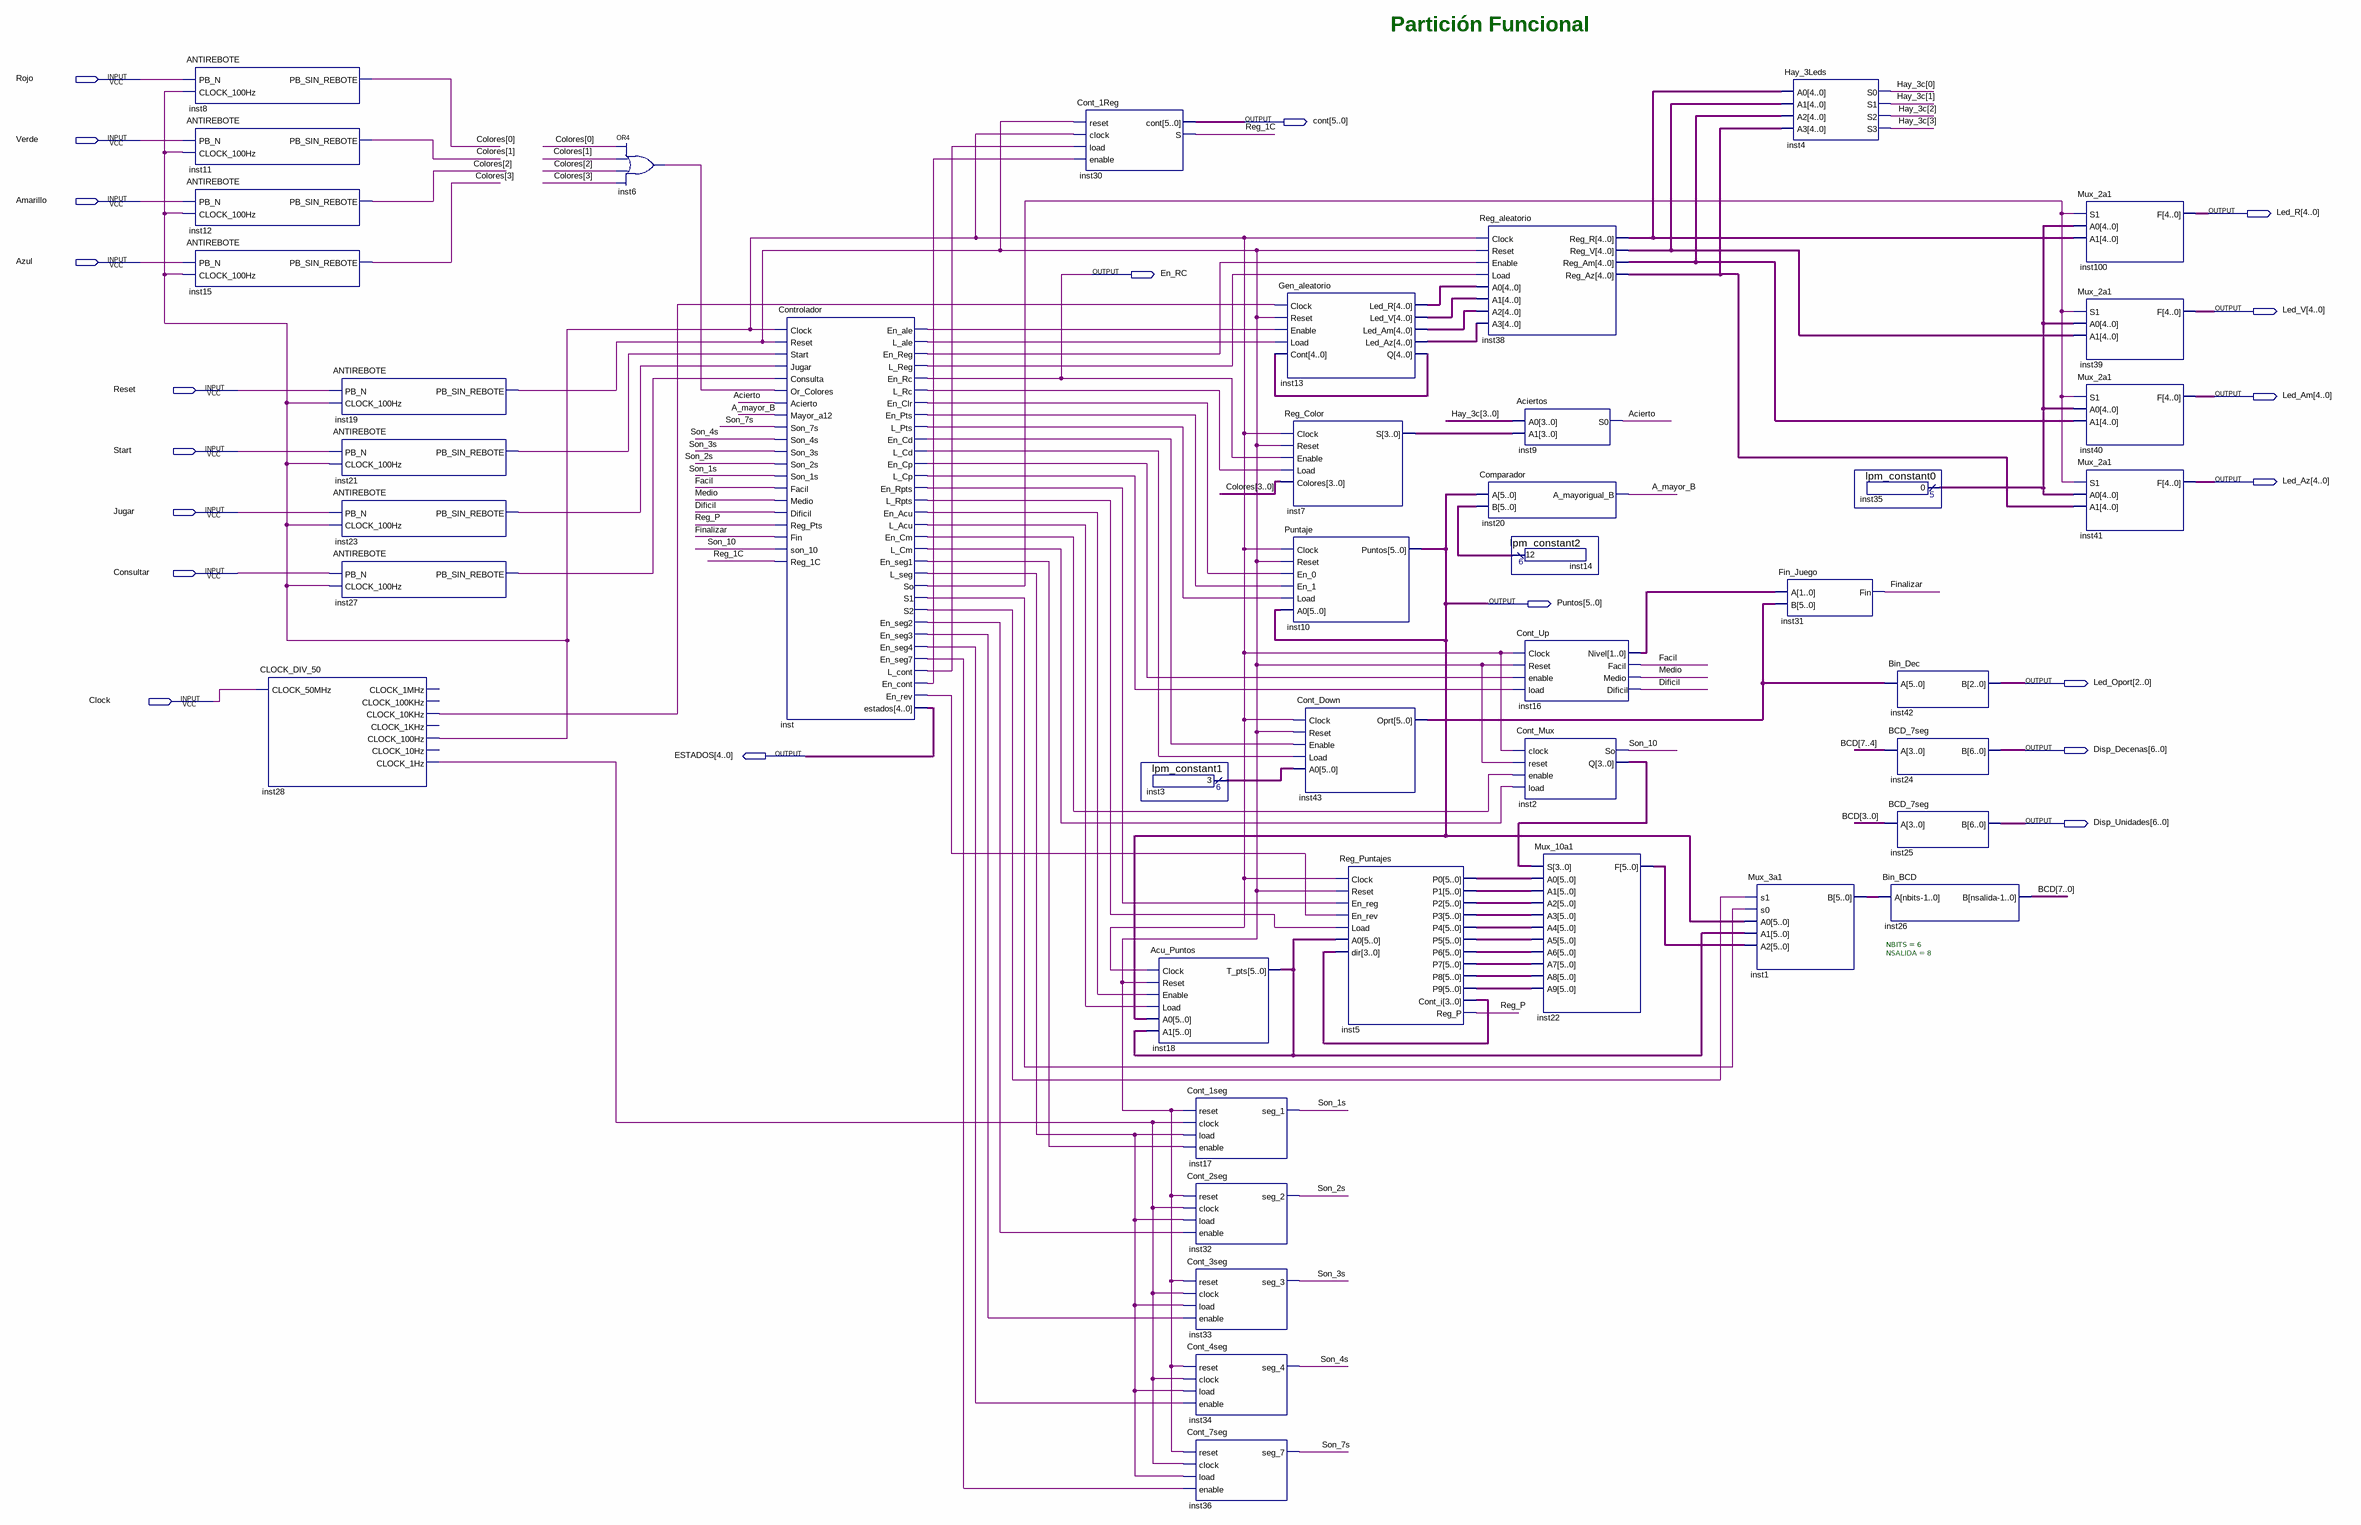
[diagram p0: schematic sheet]
// Quartus schematic Proyecto.bdf as structural Verilog: 43 symbols, 20 pins
module Proyecto (
  input  Rojo,
  input  Verde,
  input  Amarillo,
  input  Azul,
  input  Reset,
  input  Start,
  input  Jugar,
  input  Consultar,
  input  Clock,
  output [5:0] cont,
  output [4:0] Led_R,
  output En_RC,
  output [4:0] Led_V,
  output [4:0] Led_Am,
  output [4:0] Led_Az,
  output [5:0] Puntos,
  output [2:0] Led_Oport,
  output [6:0] Disp_Decenas,
  output [4:0] ESTADOS,
  output [6:0] Disp_Unidades
);

  wire A_mayor_B, Acierto, Dificil, Facil, Finalizar, inst6_out, inst19_pb_sin_rebote, inst21_pb_sin_rebote,
       inst23_pb_sin_rebote, inst27_pb_sin_rebote, inst28_clock_1hz, inst28_clock_10khz, inst28_clock_100hz,
       inst_en_acu, inst_en_ale, inst_en_cd, inst_en_clr, inst_en_cm, inst_en_cont, inst_en_cp, inst_en_pts,
       inst_en_reg, inst_en_rev, inst_en_rpts, inst_en_seg1, inst_en_seg2, inst_en_seg3, inst_en_seg4,
       inst_en_seg7, inst_l_acu, inst_l_ale, inst_l_cd, inst_l_cm, inst_l_cont, inst_l_cp, inst_l_pts,
       inst_l_rc, inst_l_reg, inst_l_rpts, inst_l_seg, inst_s1, inst_s2, inst_so, Medio, Reg_1C, Reg_P,
       Son_1s, Son_2s, Son_3s, Son_4s, Son_7s, Son_10;
  wire [1:0] inst16_nivel;
  wire [3:0] Colores, Hay_3c, inst2_q, inst5_cont_i, inst7_s;
  wire [4:0] inst13_led_am, inst13_led_az, inst13_led_r, inst13_led_v, inst13_q, inst35_result,
       inst38_reg_am, inst38_reg_az, inst38_reg_r, inst38_reg_v;
  wire [5:0] inst1_b, inst3_result, inst5_p0, inst5_p1, inst5_p2, inst5_p3, inst5_p4, inst5_p5, inst5_p6,
       inst5_p7, inst5_p8, inst5_p9, inst14_result, inst18_t_pts, inst22_f, inst43_oprt;
  wire [7:0] BCD;

  ANTIREBOTE inst8 (.PB_N(Rojo), .CLOCK_100Hz(inst28_clock_100hz), .PB_SIN_REBOTE(Colores[0]));
  ANTIREBOTE inst11 (.PB_N(Verde), .CLOCK_100Hz(inst28_clock_100hz), .PB_SIN_REBOTE(Colores[1]));
  ANTIREBOTE inst12 (.PB_N(Amarillo), .CLOCK_100Hz(inst28_clock_100hz), .PB_SIN_REBOTE(Colores[2]));
  ANTIREBOTE inst15 (.PB_N(Azul), .CLOCK_100Hz(inst28_clock_100hz), .PB_SIN_REBOTE(Colores[3]));
  CLOCK_DIV_50 inst28 (
    .CLOCK_50MHz(Clock), .CLOCK_10KHz(inst28_clock_10khz), .CLOCK_100Hz(inst28_clock_100hz),
    .CLOCK_1Hz(inst28_clock_1hz));  // open: CLOCK_1MHz, CLOCK_100KHz, CLOCK_1KHz, CLOCK_10Hz
  ANTIREBOTE inst19 (.PB_N(Reset), .CLOCK_100Hz(inst28_clock_100hz), .PB_SIN_REBOTE(inst19_pb_sin_rebote));
  ANTIREBOTE inst21 (.PB_N(Start), .CLOCK_100Hz(inst28_clock_100hz), .PB_SIN_REBOTE(inst21_pb_sin_rebote));
  ANTIREBOTE inst23 (.PB_N(Jugar), .CLOCK_100Hz(inst28_clock_100hz), .PB_SIN_REBOTE(inst23_pb_sin_rebote));
  ANTIREBOTE inst27 (.PB_N(Consultar), .CLOCK_100Hz(inst28_clock_100hz), .PB_SIN_REBOTE(inst27_pb_sin_rebote));
  or inst6 (inst6_out, Colores[0], Colores[1], Colores[2], Colores[3]);
  Controlador inst (
    .Clock(inst28_clock_100hz), .Reset(inst19_pb_sin_rebote), .Start(inst21_pb_sin_rebote),
    .Jugar(inst23_pb_sin_rebote), .Consulta(inst27_pb_sin_rebote), .Or_Colores(inst6_out), .Acierto(Acierto),
    .Mayor_a12(A_mayor_B), .Son_7s(Son_7s), .Son_4s(Son_4s), .Son_3s(Son_3s), .Son_2s(Son_2s),
    .Son_1s(Son_1s), .Facil(Facil), .Medio(Medio), .Dificil(Dificil), .Reg_Pts(Reg_P), .Fin(Finalizar),
    .son_10(Son_10), .Reg_1C(Reg_1C), .En_ale(inst_en_ale), .L_ale(inst_l_ale), .En_Reg(inst_en_reg),
    .L_Reg(inst_l_reg), .En_Rc(En_RC), .L_Rc(inst_l_rc), .En_Clr(inst_en_clr), .En_Pts(inst_en_pts),
    .L_Pts(inst_l_pts), .En_Cd(inst_en_cd), .L_Cd(inst_l_cd), .En_Cp(inst_en_cp), .L_Cp(inst_l_cp),
    .En_Rpts(inst_en_rpts), .L_Rpts(inst_l_rpts), .En_Acu(inst_en_acu), .L_Acu(inst_l_acu),
    .En_Cm(inst_en_cm), .L_Cm(inst_l_cm), .En_seg1(inst_en_seg1), .L_seg(inst_l_seg), .So(inst_so),
    .S1(inst_s1), .S2(inst_s2), .En_seg2(inst_en_seg2), .En_seg3(inst_en_seg3), .En_seg4(inst_en_seg4),
    .En_seg7(inst_en_seg7), .L_cont(inst_l_cont), .En_cont(inst_en_cont), .En_rev(inst_en_rev),
    .estados(ESTADOS));
  Cont_1Reg inst30 (
    .reset(inst19_pb_sin_rebote), .clock(inst28_clock_100hz), .load(inst_l_cont), .enable(inst_en_cont),
    .cont(cont), .S(Reg_1C));
  lpm_constant1 inst3 (.result(inst3_result));
  Acu_Puntos inst18 (
    .Clock(inst28_clock_100hz), .Reset(inst19_pb_sin_rebote), .Enable(inst_en_acu), .Load(inst_l_acu),
    .A0(Puntos), .A1(inst18_t_pts), .T_pts(inst18_t_pts));
  Cont_1seg inst17 (
    .reset(inst19_pb_sin_rebote), .clock(inst28_clock_1hz), .load(inst_l_seg), .enable(inst_en_seg1),
    .seg_1(Son_1s));
  Cont_2seg inst32 (
    .reset(inst19_pb_sin_rebote), .clock(inst28_clock_1hz), .load(inst_l_seg), .enable(inst_en_seg2),
    .seg_2(Son_2s));
  Cont_3seg inst33 (
    .reset(inst19_pb_sin_rebote), .clock(inst28_clock_1hz), .load(inst_l_seg), .enable(inst_en_seg3),
    .seg_3(Son_3s));
  Cont_4seg inst34 (
    .reset(inst19_pb_sin_rebote), .clock(inst28_clock_1hz), .load(inst_l_seg), .enable(inst_en_seg4),
    .seg_4(Son_4s));
  Cont_7seg inst36 (
    .reset(inst19_pb_sin_rebote), .clock(inst28_clock_1hz), .load(inst_l_seg), .enable(inst_en_seg7),
    .seg_7(Son_7s));
  Gen_aleatorio inst13 (
    .Clock(inst28_clock_10khz), .Reset(inst19_pb_sin_rebote), .Enable(inst_en_ale), .Load(inst_l_ale),
    .Cont(inst13_q), .Led_R(inst13_led_r), .Led_V(inst13_led_v), .Led_Am(inst13_led_am),
    .Led_Az(inst13_led_az), .Q(inst13_q));
  Reg_Color inst7 (
    .Clock(inst28_clock_100hz), .Reset(inst19_pb_sin_rebote), .Enable(En_RC), .Load(inst_l_rc),
    .Colores(Colores), .S(inst7_s));
  Puntaje inst10 (
    .Clock(inst28_clock_100hz), .Reset(inst19_pb_sin_rebote), .En_0(inst_en_clr), .En_1(inst_en_pts),
    .Load(inst_l_pts), .A0(Puntos), .Puntos(Puntos));
  Cont_Down inst43 (
    .Clock(inst28_clock_100hz), .Reset(inst19_pb_sin_rebote), .Enable(inst_en_cd), .Load(inst_l_cd),
    .A0(inst3_result), .Oprt(inst43_oprt));
  Reg_Puntajes inst5 (
    .Clock(inst28_clock_100hz), .Reset(inst19_pb_sin_rebote), .En_reg(inst_en_rpts), .En_rev(inst_en_rev),
    .Load(inst_l_rpts), .A0(inst18_t_pts), .dir(inst5_cont_i), .P0(inst5_p0), .P1(inst5_p1), .P2(inst5_p2),
    .P3(inst5_p3), .P4(inst5_p4), .P5(inst5_p5), .P6(inst5_p6), .P7(inst5_p7), .P8(inst5_p8), .P9(inst5_p9),
    .Cont_i(inst5_cont_i), .Reg_P(Reg_P));
  Reg_aleatorio inst38 (
    .Clock(inst28_clock_100hz), .Reset(inst19_pb_sin_rebote), .Enable(inst_en_reg), .Load(inst_l_reg),
    .A0(inst13_led_r), .A1(inst13_led_v), .A2(inst13_led_am), .A3(inst13_led_az), .Reg_R(inst38_reg_r),
    .Reg_V(inst38_reg_v), .Reg_Am(inst38_reg_am), .Reg_Az(inst38_reg_az));
  Comparador inst20 (.A(Puntos), .B(inst14_result), .A_mayorigual_B(A_mayor_B));
  Aciertos inst9 (.A0(Hay_3c), .A1(inst7_s), .S0(Acierto));
  lpm_constant2 inst14 (.result(inst14_result));
  Cont_Up inst16 (
    .Clock(inst28_clock_100hz), .Reset(inst19_pb_sin_rebote), .enable(inst_en_cp), .load(inst_l_cp),
    .Nivel(inst16_nivel), .Facil(Facil), .Medio(Medio), .Dificil(Dificil));
  Cont_Mux inst2 (
    .clock(inst28_clock_100hz), .reset(inst19_pb_sin_rebote), .enable(inst_en_cm), .load(inst_l_cm),
    .So(Son_10), .Q(inst2_q));
  Mux_10a1 inst22 (
    .S(inst2_q), .A0(inst5_p0), .A1(inst5_p1), .A2(inst5_p2), .A3(inst5_p3), .A4(inst5_p4), .A5(inst5_p5),
    .A6(inst5_p6), .A7(inst5_p7), .A8(inst5_p8), .A9(inst5_p9), .F(inst22_f));
  Mux_3a1 inst1 (.s1(inst_s2), .s0(inst_s1), .A0(Puntos), .A1(inst18_t_pts), .A2(inst22_f), .B(inst1_b));
  Hay_3Leds inst4 (
    .A0(inst38_reg_r), .A1(inst38_reg_v), .A2(inst38_reg_am), .A3(inst38_reg_az), .S0(Hay_3c[0]),
    .S1(Hay_3c[1]), .S2(Hay_3c[2]), .S3(Hay_3c[3]));
  Fin_Juego inst31 (.A(inst16_nivel), .B(inst43_oprt), .Fin(Finalizar));
  lpm_constant0 inst35 (.result(inst35_result));
  Bin_Dec inst42 (.A(inst43_oprt), .B(Led_Oport));
  BCD_7seg inst24 (.A(BCD[7:4]), .B(Disp_Decenas));
  BCD_7seg inst25 (.A(BCD[3:0]), .B(Disp_Unidades));
  Bin_BCD #(.NBITS(6), .NSALIDA(8)) inst26 (.A(inst1_b), .B(BCD));
  Mux_2a1 inst100 (.S1(inst_so), .A0(inst35_result), .A1(inst38_reg_r), .F(Led_R));
  Mux_2a1 inst39 (.S1(inst_so), .A0(inst35_result), .A1(inst38_reg_v), .F(Led_V));
  Mux_2a1 inst40 (.S1(inst_so), .A0(inst35_result), .A1(inst38_reg_am), .F(Led_Am));
  Mux_2a1 inst41 (.S1(inst_so), .A0(inst35_result), .A1(inst38_reg_az), .F(Led_Az));

  // Notes on the sheet:
  //   Partición Funcional
endmodule
